# Altium schematic sheet Cyclone_Mainboard.SchDoc
size A4; SheetNumber: 1; SheetTotal: 1
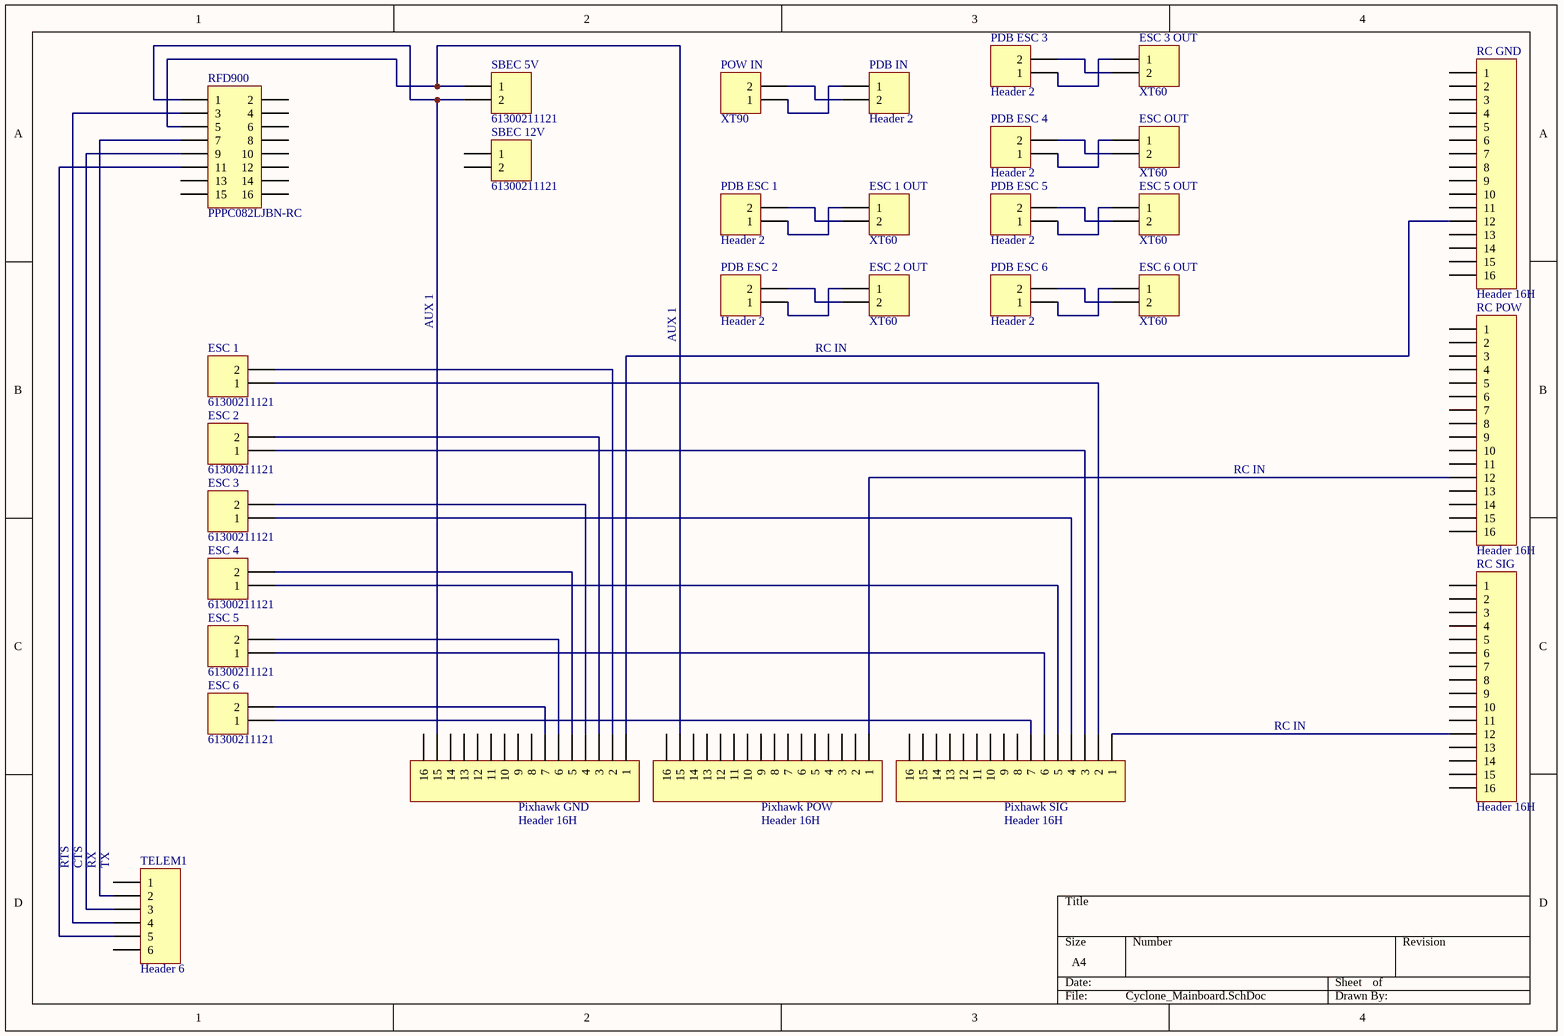
[diagram p0: Cyclone_Mainboard.SchDoc]

## Parts
ESC_1  61300211121  [HDR1X2]
ESC_1_OUT  XT60  [HDR1X2]
ESC_2  61300211121  [HDR1X2]
ESC_2_OUT  XT60  [HDR1X2]
ESC_3  61300211121  [HDR1X2]
ESC_3_OUT  XT60  [HDR1X2]
ESC_4  61300211121  [HDR1X2]
ESC_5  61300211121  [HDR1X2]
ESC_5_OUT  XT60  [HDR1X2]
ESC_6  61300211121  [HDR1X2]
ESC_6_OUT  XT60  [HDR1X2]
ESC_OUT  XT60  [HDR1X2]
PDB_ESC_1  Header 2  [HDR1X2]
PDB_ESC_2  Header 2  [HDR1X2]
PDB_ESC_3  Header 2  [HDR1X2]
PDB_ESC_4  Header 2  [HDR1X2]
PDB_ESC_5  Header 2  [HDR1X2]
PDB_ESC_6  Header 2  [HDR1X2]
PDB_IN  Header 2  [HDR1X2]
Pixhawk_GND  Header 16H  [HDR1X16H]
Pixhawk_POW  Header 16H  [HDR1X16H]
Pixhawk_SIG  Header 16H  [HDR1X16H]
POW_IN  XT90  [HDR1X2]
RC_GND  Header 16H  [HDR1X16H]
RC_POW  Header 16H  [HDR1X16H]
RC_SIG  Header 16H  [HDR1X16H]
RFD900  PPPC082LJBN-RC  [HDR2X8H]
SBEC_5V  61300211121  [HDR1X2]
SBEC_12V  61300211121  [HDR1X2]
TELEM1  Header 6  [HDR1X6]

## Nets
NetESC_1_1: ESC_1.1 Pixhawk_SIG.2
NetESC_1_2: ESC_1.2 Pixhawk_GND.2
NetESC_1_OUT_1: ESC_1_OUT.1 PDB_ESC_1.1
NetESC_1_OUT_2: ESC_1_OUT.2 PDB_ESC_1.2
NetESC_2_1: ESC_2.1 Pixhawk_SIG.3
NetESC_2_2: ESC_2.2 Pixhawk_GND.3
NetESC_2_OUT_1: ESC_2_OUT.1 PDB_ESC_2.1
NetESC_2_OUT_2: ESC_2_OUT.2 PDB_ESC_2.2
NetESC_3_1: ESC_3.1 Pixhawk_SIG.4
NetESC_3_2: ESC_3.2 Pixhawk_GND.4
NetESC_3_OUT_1: ESC_3_OUT.1 PDB_ESC_3.1
NetESC_3_OUT_2: ESC_3_OUT.2 PDB_ESC_3.2
NetESC_4_1: ESC_4.1 Pixhawk_SIG.5
NetESC_4_2: ESC_4.2 Pixhawk_GND.5
NetESC_5_1: ESC_5.1 Pixhawk_SIG.6
NetESC_5_2: ESC_5.2 Pixhawk_GND.6
NetESC_5_OUT_1: ESC_5_OUT.1 PDB_ESC_5.1
NetESC_5_OUT_2: ESC_5_OUT.2 PDB_ESC_5.2
NetESC_6_1: ESC_6.1 Pixhawk_SIG.7
NetESC_6_2: ESC_6.2 Pixhawk_GND.7
NetESC_6_OUT_1: ESC_6_OUT.1 PDB_ESC_6.1
NetESC_6_OUT_2: ESC_6_OUT.2 PDB_ESC_6.2
NetESC_OUT_1: ESC_OUT.1 PDB_ESC_4.1
NetESC_OUT_2: ESC_OUT.2 PDB_ESC_4.2
NetPDB_IN_1: PDB_IN.1 POW_IN.1
NetPDB_IN_2: PDB_IN.2 POW_IN.2
NetPixhawk_GND_1: Pixhawk_GND.1 RC_GND.12
NetPixhawk_GND_15: Pixhawk_GND.15 RFD900.1 SBEC_5V.2
NetPixhawk_POW_1: Pixhawk_POW.1 RC_POW.12
NetPixhawk_POW_15: Pixhawk_POW.15 RFD900.5 SBEC_5V.1
NetPixhawk_SIG_1: Pixhawk_SIG.1 RC_SIG.12
NetRFD900_3: RFD900.3 TELEM1.4
NetRFD900_7: RFD900.7 TELEM1.2
NetRFD900_9: RFD900.9 TELEM1.3
NetRFD900_11: RFD900.11 TELEM1.5

Not connected (* = marked no-connect by the designer): Pixhawk_GND 8 9 10 11 12 13 14 16; Pixhawk_POW 2 3 4 5 6 7 8 9 10 11 12 13 14 16; Pixhawk_SIG 8 9 10 11 12 13 14 15 16; RC_GND 1 2 3 4 5 6 7 8 9 10 11 13 14 15 16; RC_POW 1 2 3 4 5 6 7 8 9 10 11 13 14 15 16; RC_SIG 1 2 3 4 5 6 7 8 9 10 11 13 14 15 16; RFD900 2 4 6 8 10 12 13 14 15 16; SBEC_12V 1 2; TELEM1 1 6

## Notes on the sheet
- AUX 1
- RC IN
- RTS
- CTS
- (near TELEM1) RX
- (near TELEM1) TX

## Library data of the parts
ESC_1 ESC_1_OUT ESC_2 ESC_2_OUT ESC_3 ESC_3_OUT ESC_4 ESC_5 ESC_5_OUT ESC_6 ESC_6_OUT ESC_OUT PDB_ESC_1-PDB_ESC_6 PDB_IN POW_IN SBEC_5V SBEC_12V = Header 2: Header, 2-Pin; LatestRevisionDate: 17-Jul-2002; LatestRevisionNote: Re-released for DXP Platform.; Publisher: Altium Limited
  ESC_1-ESC_6 SBEC_5V SBEC_12V: Supplier 1: Newark; Supplier Part Number 1: 20X0948
  ESC_1_OUT ESC_2_OUT ESC_3_OUT ESC_5_OUT ESC_6_OUT ESC_OUT: Supplier 1: Digi-Key; Supplier Part Number 1: 1568-1816-ND
Pixhawk_GND Pixhawk_POW Pixhawk_SIG RC_GND RC_POW RC_SIG = Header 16H: Header, 16-Pin, Right Angle; LatestRevisionDate: 17-Jul-2002; LatestRevisionNote: Re-released for DXP Platform.; Publisher: Altium Limited
RFD900 = Header 8X2H: Header, 8-Pin, Dual row, Right Angle; LatestRevisionDate: 17-Jul-2002; LatestRevisionNote: Re-released for DXP Platform.; Publisher: Altium Limited; Supplier 1: Digi-Key; Supplier Part Number 1: S5561-ND
TELEM1 = Header 6: Header, 6-Pin; LatestRevisionDate: 17-Jul-2002; LatestRevisionNote: Re-released for DXP Platform.; Publisher: Altium Limited